# Altium schematic sheet CpuMY.SchDoc
size A3
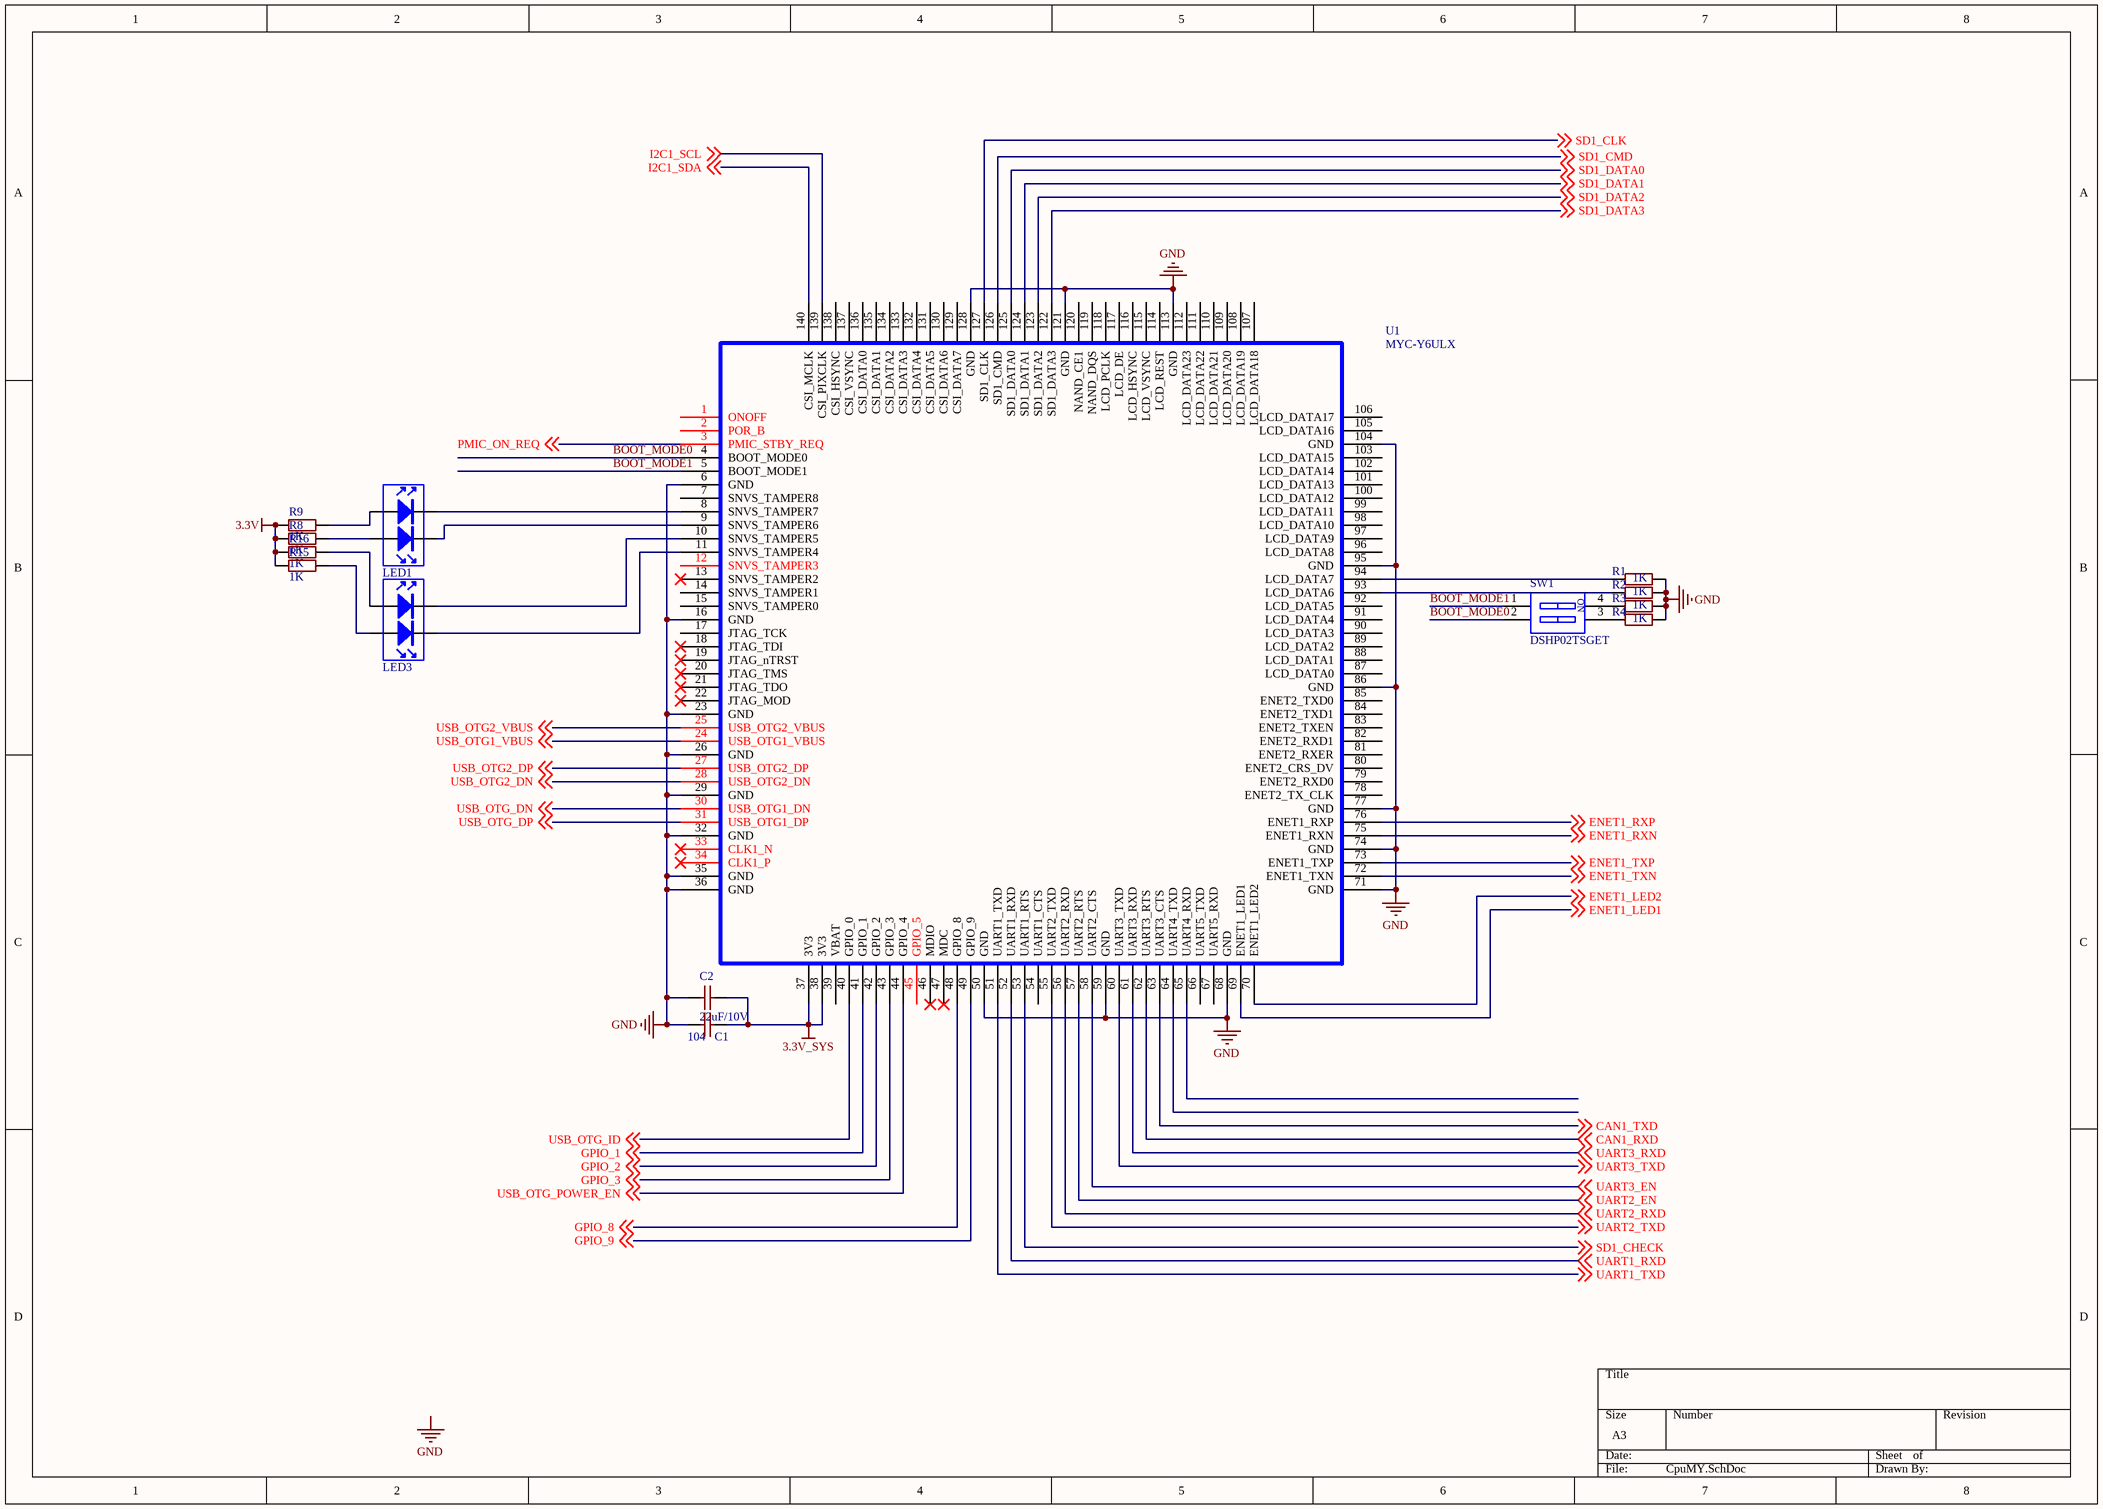
[diagram p0: CpuMY.SchDoc]

## Parts
C1  104  [0805SMD_Cap]
C2  22uF/10V  [0805SMD_Cap]
LED1  LED_1  [DIP LED]  (value not drawn)
LED3  LED_1  [DIP LED]  (value not drawn)
R1  1K  [0805_SMD_R]
R2  1K  [0805_SMD_R]
R3  1K  [0805_SMD_R]
R4  1K  [0805_SMD_R]
R8  1K  [0805_SMD_R]
R9  1K  [0805_SMD_R]
R15  1K  [0805_SMD_R]
R16  1K  [0805_SMD_R]
SW1  DSHP02TSGET  [DSHP02TSGET]
U1  MYC-Y6ULX  [MYIMX6]

## Nets
3.3V: R8.1 R9.1 R15.2 R16.2
3.3V_SYS: C1.2 C2.1 U1.37(3V3) U1.38(3V3)
GND: C1.1 C2.2 R1.2 R2.2 R3.2 R4.2 U1.6(GND) U1.16(GND) U1.23(GND) U1.26(GND) U1.29(GND) U1.32(GND) U1.35(GND) U1.36(GND) U1.50(GND) U1.59(GND) U1.68(GND) U1.71(GND) U1.74(GND) U1.77(GND) U1.86(GND) U1.95(GND) U1.104(GND) U1.113(GND) U1.121(GND) U1.128(GND)
BOOT_MODE0: SW1.2(A2) U1.4(BOOT_MODE0)
BOOT_MODE1: SW1.1(A1) U1.5(BOOT_MODE1)
CAN1_RXD: U1.62(UART3_RTS) ; off-sheet CAN1_RXD
CAN1_TXD: U1.63(UART3_CTS) ; off-sheet CAN1_TXD
ENET1_LED1: U1.69(ENET1_LED1) ; off-sheet ENET1_LED1
ENET1_LED2: U1.70(ENET1_LED2) ; off-sheet ENET1_LED2
ENET1_RXN: U1.75(ENET1_RXN) ; off-sheet ENET1_RXN
ENET1_RXP: U1.76(ENET1_RXP) ; off-sheet ENET1_RXP
ENET1_TXN: U1.72(ENET1_TXN) ; off-sheet ENET1_TXN
ENET1_TXP: U1.73(ENET1_TXP) ; off-sheet ENET1_TXP
GPIO_1: U1.41(GPIO_1) ; off-sheet GPIO_1
GPIO_2: U1.42(GPIO_2) ; off-sheet GPIO_2
GPIO_3: U1.43(GPIO_3) ; off-sheet GPIO_3
GPIO_8: U1.48(GPIO_8) ; off-sheet GPIO_8
GPIO_9: U1.49(GPIO_9) ; off-sheet GPIO_9
I2C1_SCL: U1.139(CSI_PIXCLK) ; off-sheet I2C1_SCL
I2C1_SDA: U1.140(CSI_MCLK) ; off-sheet I2C1_SDA
PMIC_ON_REQ: U1.3(PMIC_STBY_REQ) ; off-sheet PMIC_ON_REQ
SD1_CHECK: U1.53(UART1_RTS) ; off-sheet SD1_CHECK
SD1_CLK: U1.127(SD1_CLK) ; off-sheet SD1_CLK
SD1_CMD: U1.126(SD1_CMD) ; off-sheet SD1_CMD
SD1_DATA0: U1.125(SD1_DATA0) ; off-sheet SD1_DATA0
SD1_DATA1: U1.124(SD1_DATA1) ; off-sheet SD1_DATA1
SD1_DATA2: U1.123(SD1_DATA2) ; off-sheet SD1_DATA2
SD1_DATA3: U1.122(SD1_DATA3) ; off-sheet SD1_DATA3
UART1_RXD: U1.52(UART1_RXD) ; off-sheet UART1_RXD
UART1_TXD: U1.51(UART1_TXD) ; off-sheet UART1_TXD
UART2_EN: U1.57(UART2_RTS) ; off-sheet UART2_EN
UART2_RXD: U1.56(UART2_RXD) ; off-sheet UART2_RXD
UART2_TXD: U1.55(UART2_TXD) ; off-sheet UART2_TXD
UART3_EN: U1.58(UART2_CTS) ; off-sheet UART3_EN
UART3_RXD: U1.61(UART3_RXD) ; off-sheet UART3_RXD
UART3_TXD: U1.60(UART3_TXD) ; off-sheet UART3_TXD
USB_OTG1_VBUS: U1.24(USB_OTG1_VBUS) ; off-sheet USB_OTG1_VBUS
USB_OTG2_DN: U1.28(USB_OTG2_DN) ; off-sheet USB_OTG2_DN
USB_OTG2_DP: U1.27(USB_OTG2_DP) ; off-sheet USB_OTG2_DP
USB_OTG2_VBUS: U1.25(USB_OTG2_VBUS) ; off-sheet USB_OTG2_VBUS
USB_OTG_DN: U1.30(USB_OTG1_DN) ; off-sheet USB_OTG_DN
USB_OTG_DP: U1.31(USB_OTG1_DP) ; off-sheet USB_OTG_DP
USB_OTG_ID: U1.40(GPIO_0) ; off-sheet USB_OTG_ID
USB_OTG_POWER_EN: U1.44(GPIO_4) ; off-sheet USB_OTG_POWER_EN
NetLED1_1: LED1.1 R9.2
NetLED1_2: LED1.2 U1.8(SNVS_TAMPER7)
NetLED1_3: LED1.3 R8.2
NetLED1_4: LED1.4 U1.9(SNVS_TAMPER6)
NetLED3_1: LED3.1 R16.1
NetLED3_2: LED3.2 U1.10(SNVS_TAMPER5)
NetLED3_3: LED3.3 R15.1
NetLED3_4: LED3.4 U1.11(SNVS_TAMPER4)
NetR1_1: R1.1 U1.94(LCD_DATA7)
NetR2_1: R2.1 U1.93(LCD_DATA6)
NetR3_1: R3.1 SW1.4(B1)
NetR4_1: R4.1 SW1.3(B2)

Not connected (* = marked no-connect by the designer): U1 1(ONOFF) 2(POR_B) 7(SNVS_TAMPER8) 12(SNVS_TAMPER3) 13(SNVS_TAMPER2)* 14(SNVS_TAMPER1) 15(SNVS_TAMPER0) 17(JTAG_TCK) 18(JTAG_TDI)* 19(JTAG_nTRST)* 20(JTAG_TMS)* 21(JTAG_TDO)* 22(JTAG_MOD)* 33(CLK1_N)* 34(CLK1_P)* 39(VBAT) 45(GPIO_5) 46(MDIO)* 47(MDC)* 54(UART1_CTS) 64(UART4_TXD) 65(UART4_RXD) 66(UART5_TXD) 67(UART5_RXD) 78(ENET2_TX_CLK) 79(ENET2_RXD0) 80(ENET2_CRS_DV) 81(ENET2_RXER) 82(ENET2_RXD1) 83(ENET2_TXEN) 84(ENET2_TXD1) 85(ENET2_TXD0) 87(LCD_DATA0) 88(LCD_DATA1) 89(LCD_DATA2) 90(LCD_DATA3) 91(LCD_DATA4) 92(LCD_DATA5) 96(LCD_DATA8) 97(LCD_DATA9) 98(LCD_DATA10) 99(LCD_DATA11) 100(LCD_DATA12) 101(LCD_DATA13) 102(LCD_DATA14) 103(LCD_DATA15) 105(LCD_DATA16) 106(LCD_DATA17) 107(LCD_DATA18) 108(LCD_DATA19) 109(LCD_DATA20) 110(LCD_DATA21) 111(LCD_DATA22) 112(LCD_DATA23) 114(LCD_REST) 115(LCD_VSYNC) 116(LCD_HSYNC) 117(LCD_DE) 118(LCD_PCLK) 119(NAND_DQS) 120(NAND_CE1) 129(CSI_DATA7) 130(CSI_DATA6) 131(CSI_DATA5) 132(CSI_DATA4) 133(CSI_DATA3) 134(CSI_DATA2) 135(CSI_DATA1) 136(CSI_DATA0) 137(CSI_VSYNC) 138(CSI_HSYNC)

## Notes on the sheet
- Labels drawn without touching a wire or pin: GND
- (in symbol 拨码开关) ON

## Library data of the parts
C1 = SMD_Cap: 贴片电容; 研究所: 贴装电容_0805_0.1uF; 松下: GR21BB1H104K; 松下: GR21BB1H224K; 松下: GR21BB1H103K; 研究所: 贴装电容_0805_0.22uF; 研究所: 贴装电容_0805_0.01uF; 松下: GR21BB1H473K; 研究所: 贴装电容_0805_0.047uF; 松下: GR21BB1H300K; 研究所: 贴装电容_0805_30pF; 松下: GR21BB1H105K; 研究所: 贴装电容_0805_1uF; 松下: GR21BB1H472K; 研究所: 贴装电容_0805_4700pF
C2 = SMD_Cap: 贴片电容; 研究所: 贴装电容_0805_4700pF; 松下: GR21BB1H472K
LED1 LED3 = LED_1: 发光二极管
R1-R4 R8 R9 R15 R16 = SMD_0805: 贴片电阻; 松下: RS05K101FT; 松下: RS05000FT; 松下: RS05K3321FT; 松下: RS05K6811FT; 松下: RS05K102FT; 松下: RS05K2211FT; 松下: RS05K103FT; 松下: RS05K5111FT; 松下: RS05K5110FT; 松下: RS05K5112FT; 松下: RS05K8251FT; 松下: RS05K2212FT; 松下: RS05K104FT; 松下: RS05K5113FT; 松下: RS05K105FT; 松下: RS05L106FT; 研究所: 贴装电阻_0805_0_F1%; 研究所: 贴装电阻_0805_100_F1%; 研究所: 贴装电阻_0805_51.1K_F1%; 研究所: 贴装电阻_0805_1K_F1%; 研究所: 贴装电阻_0805_2.21K_F1%; 研究所: 贴装电阻_0805_3.32K_F1%; 研究所: 贴装电阻_0805_5.11K_F1%; 研究所: 贴装电阻_0805_511K_F1%; 研究所: 贴装电阻_0805_6.81K_F1%; 研究所: 贴装电阻_0805_511_F1%; 研究所: 贴装电阻_0805_8.25K_F1%; 研究所: 贴装电阻_0805_10K_F1%; 研究所: 贴装电阻_0805_22.1K_F1%; 研究所: 贴装电阻_0805_100K_F1%; 研究所: 贴装电阻_0805_1M_F1%; 研究所: 贴装电阻_0805_10M_F1%
SW1 = 拨码开关